# Altium schematic sheet PMU.SchDoc
size A4
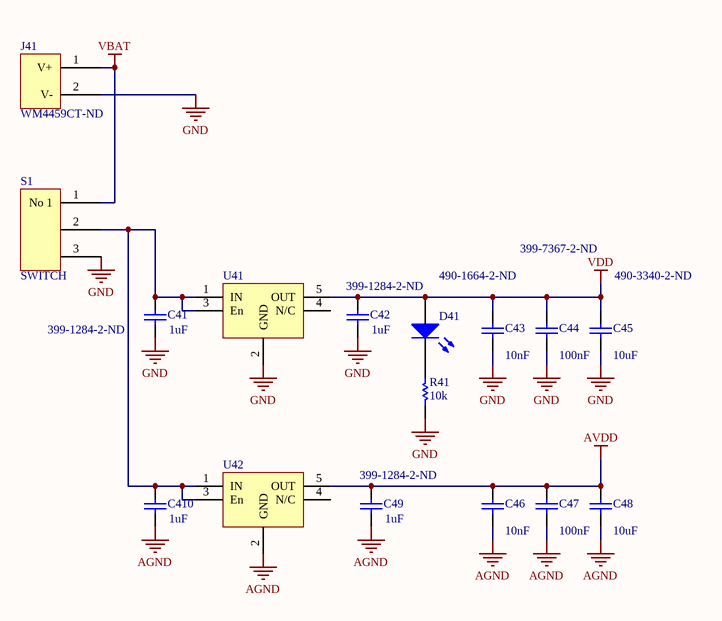
[diagram p0: PMU.SchDoc]

## Parts
C41  value 1uF  Supplier Part Number 1: 399-1284-2-ND  [0402]  (hidden comment: Cap Semi)
C42  value 1uF  Supplier Part Number 1: 399-1284-2-ND  [0402]  (hidden comment: Cap Semi)
C43  value 10nF  Supplier Part Number 1: 490-1664-2-ND  [0402]  (hidden comment: Cap Semi)
C44  value 100nF  Supplier Part Number 1: 399-7367-2-ND  [0402]  (hidden comment: Cap Semi)
C45  value 10uF  Supplier Part Number 1: 490-3340-2-ND  [0402]  (hidden comment: Cap Semi)
C46  value 10nF  [0402]  (hidden comment: Cap Semi)
C47  value 100nF  [0402]  (hidden comment: Cap Semi)
C48  value 10uF  [0402]  (hidden comment: Cap Semi)
C49  value 1uF  Supplier Part Number 1: 399-1284-2-ND  [0402]  (hidden comment: Cap Semi)
C410  value 1uF  [0402]  (hidden comment: Cap Semi)
D41  Alim led verte  [0805 (2012 metric)]  (value not drawn)
J41  WM4459CT-ND  [WM4459CT-ND]
R41  value 10k  [0402]
S1  SWITCH  [CUS-12B]
U41  Reg 3.3V  [TSOP-5ll]  (value not drawn)
U42  Reg 3.3V  [TSOP-5ll]  (value not drawn)

## Nets
AGND: C46.1 C47.1 C48.1 C49.1 C410.1 U42.2(GND)
AVDD: C46.2 C47.2 C48.2 C49.2 U42.5(OUT)
GND: C41.1 C42.1 C43.1 C44.1 C45.1 J41.2(V-) R41.2 S1.3 U41.2(GND)
VBAT: J41.1(V+) S1.1(No_1)
VDD: C42.2 C43.2 C44.2 C45.2 D41.1(A) U41.5(OUT)
NetC41_2: C41.2 C410.2 S1.2 U41.1(IN) U41.3(En) U42.1(IN) U42.3(En)
NetD41_2: D41.2(K) R41.1

Not connected (* = marked no-connect by the designer): U41 4(N/C); U42 4(N/C)

## Library data of the parts
C41-C49 C410 = Cap Semi: Capacitor (Semiconductor SIM Model); Published: 8-Jun-2000; LatestRevisionDate: 29-May-2009; LatestRevisionNote: IPC-7351 Footprint Added.; PackageReference: C1206; Publisher: Altium Limited; PackageDescription: Chip Capacitor; Supplier 1: Digi-Key
  C46: Supplier Part Number 1: 490-1664-2-ND
  C47: Supplier Part Number 1: 399-7367-2-ND
  C48: Supplier Part Number 1: 490-3340-2-ND
  C410: Supplier Part Number 1: 399-1284-2-ND
D41 = LED3: LED 2X1.2MM 570NM GN WTR CLR SMD; Supplier 1: Digi-Key; Supplier Part Number 1: 754-1127-1-ND
R41 = Res Semi: Semiconductor Resistor; Published: 8-Jun-2000; LatestRevisionDate: 17-Jul-2002; LatestRevisionNote: Re-released for DXP Platform.; PackageReference: AXIAL-0.5; Publisher: Altium Limited; PackageDescription: Axial Device, Thru-Hole; 2 Leads; 0.5 in Pin Spacing
S1 = Component_1
U41 U42 = NCP603SN330T1G: IC REG LDO 3.3V 0.3A 5TSOP; Supplier 1: Digi-Key; Supplier Part Number 1: NCP603SN330T1GOSCT-ND